# Altium project PCB.PrjPcb
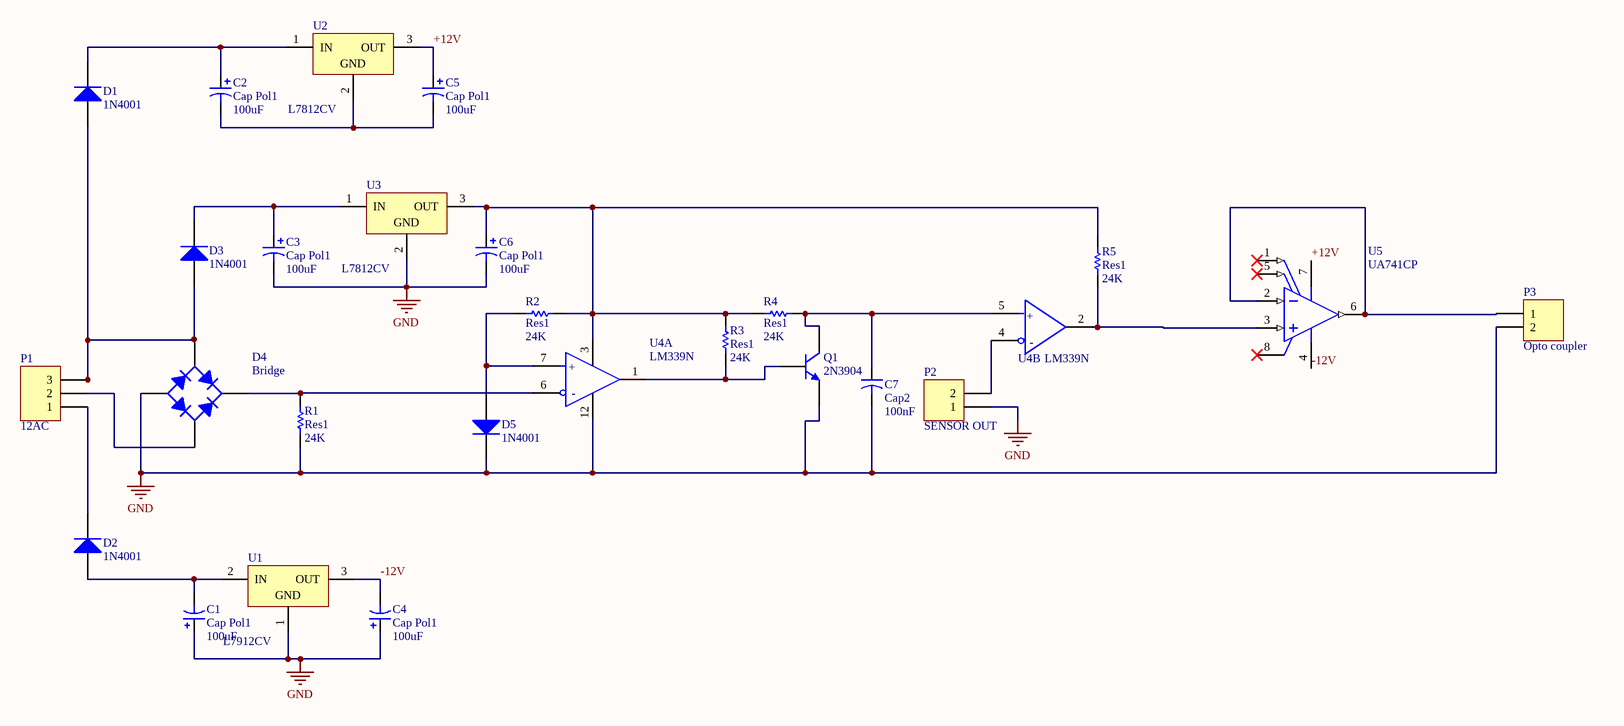
[diagram p0: Triac.SchDoc]
3 sheets, 81 parts. Net scope: global (net labels, ports and power ports of the same name join across sheets).
Board file: PCB1.PcbDoc
Sheets:
  Triac.SchDoc
  sensor.SchDoc
  pid.SchDoc

## Sheet Triac.SchDoc
size A3; SheetNumber: 1; SheetTotal: 3

### Parts
C1  Cap Pol1  value 100uF  [RB7.6-15]
C2  Cap Pol1  value 100uF  [RB7.6-15]
C3  Cap Pol1  value 100uF  [RB7.6-15]
C4  Cap Pol1  value 100uF  [RB7.6-15]
C5  Cap Pol1  value 100uF  [RB7.6-15]
C6  Cap Pol1  value 100uF  [RB7.6-15]
C7  Cap2  value 100nF  [CAPR5-4X5]
D1  1N4001  [DO-41]
D2  1N4001  [DO-41]
D3  1N4001  [DO-41]
D4  Bridge  [D-38]
D5  1N4001  [DO-41]
P1  12AC  [HDR1X3]
P2  SENSOR OUT  [HDR1X2]
P3  Opto coupler  [HDR1X2]
Q1  2N3904  [ONSC-TO-92-3-29-11]
R1  Res1  value 24K  [AXIAL-0.3]
R2  Res1  value 24K  [AXIAL-0.3]
R3  Res1  value 24K  [AXIAL-0.3]
R4  Res1  value 24K  [AXIAL-0.3]
R5  Res1  value 24K  [AXIAL-0.3]
U1  L7912CV  [TO-220]
U2  L7812CV  [TO220]
U3  L7812CV  [TO220]
U4  LM339N  [FP-N0014A-MFG]  (parts A,B of 4)
U5  UA741CP  [P0008A]

### Nets
GND: C1.1 C3.2 C4.1 C6.2 C7.2 D4.3(A) D5.2(K) P2.1 P3.2 Q1.1(C) R1.1 U1.1(GND) U3.2(GND) U4.12(GND)
+12V: C5.1 U2.3(OUT) U5.7(VCC+)
-12V: C4.2 U1.3(OUT) U5.4(VCC-)
NetC1_2: C1.2 D2.1(A) U1.2(IN)
NetC2_1: C2.1 D1.2(K) U2.1(IN)
NetC2_2: C2.2 C5.2 U2.2(GND)
NetC3_1: C3.1 D3.2(K) U3.1(IN)
NetC6_1: C6.1 R2.1 R3.1 R4.1 R5.2 U3.3(OUT) U4.3(VCC)
NetC7_1: C7.1 Q1.3(E) R4.2 U4.5(2IN+)
NetD1_1: D1.1(A) D3.1(A) D4.4(C) P1.3
NetD2_2: D2.2(K) P1.1
NetD4_1: D4.1(K) R1.2 U4.6(1IN-)
NetD4_2: D4.2(C) P1.2
NetD5_1: D5.1(A) R2.2 U4.7(1IN+)
NetP2_2: P2.2 U4.4(2IN-)
NetP3_1: P3.1 U5.2(IN-) U5.6(OUT)
NetQ1_2: Q1.2(B) R3.2 U4.1(1OUT)
NetR5_1: R5.1 U4.2(2OUT) U5.3(IN+)

Not connected (* = marked no-connect by the designer): U5 1(OFFSET_N1)* 5(OFFSET_N2)* 8(NC)*

### Notes on the sheet
- (in symbol CMP-0055-00143-4, part A) +; -
- (in symbol CMP-0055-00143-4, part B) +; -

### Library data of the parts
C1-C6 = Cap Pol1: Polarized Capacitor (Radial); Published: 8-Jun-2000; LatestRevisionDate: 17-Jul-2002; LatestRevisionNote: Re-released for DXP Platform.; PackageReference: RB7.6-15; Publisher: Altium Limited; PackageDescription: Polarized Capacitor (Radial); 2 Leads
C7 = Cap2: Capacitor; Published: 23-Sep-2002; PackageReference: CAPR5-4X5; Publisher: Altium Limited; PackageDescription: Capacitor; 2 Leads
D1-D3 D5 = Diode 1N4001: 1 Amp General Purpose Rectifier; Published: 8-Jun-2000; LatestRevisionDate: 17-Jul-2002; LatestRevisionNote: Re-released for DXP Platform.; DatasheetVersion: 1998; PackageVersion: Aug-1999; PackageReference: DO-41; Publisher: Altium Limited; PackageDescription: Diode, Axial; Body 5.2 x 2.7 mm (LxDia. max), Lead Dia. 0.86 mm (max); Code_JEDEC: DO-204-AL; ComponentLink1Description: Manufacturer Link; ComponentLink1URL: http://www.fairchildsemi.com/; ComponentLink2Description: Datasheet; ComponentLink2URL: http://www.fairchildsemi.com/ds/1N%2F1N4001.pdf
D4 = Bridge1: Full Wave Diode Bridge; Published: 8-Jun-2000; LatestRevisionDate: 29-May-2009; LatestRevisionNote: Sch pins A & K swapped.; DatasheetVersion: E2732B; PackageReference: D-38; Publisher: Altium Limited; PackageDescription: Bridge Rectifier; 4 Terminals; Body 9.4 x 9.4 mm (typ); Pitch 5.08 mm
P1 = Header 3: Header, 3-Pin; LatestRevisionDate: 17-Jul-2002; LatestRevisionNote: Re-released for DXP Platform.; Publisher: Altium Limited
P2 P3 = Header 2: Header, 2-Pin; LatestRevisionDate: 17-Jul-2002; LatestRevisionNote: Re-released for DXP Platform.; Publisher: Altium Limited
Q1 = NPN: NPN Bipolar Transistor; Published: 8-Jun-2000; LatestRevisionDate: 17-Jul-2002; LatestRevisionNote: Re-released for DXP Platform.; PackageReference: TO-226-AA; Publisher: Altium Limited; PackageDescription: TO, Flat Index; 3 In-Line, Axial Leads; Body Dia. 4.8mm; Leads 0.55 x 0.51 mm (max); Code_JEDEC: TO-226-AA
R1-R5 = Res1: Resistor; Published: 8-Jun-2000; LatestRevisionDate: 17-Jul-2002; LatestRevisionNote: Re-released for DXP Platform.; PackageReference: AXIAL-0.3; Publisher: Altium Limited; PackageDescription: Axial Device, Thru-Hole; 2 Leads; 0.3 in Pin Spacing
U1 = CMP-0244-00457-1: Negative Voltage Regulator, -12V, 3-Pin TO-220; PackageReference: TO-220; PackageVersion: 2011; PackageDescription: TO, Thru-Hole, Vertical, Heatsink Mounted; 3 In-Line Leads; Pitch 2.54 mm; ComponentLink1Description: Manufacturer URL; ComponentLink2URL: http://www.st.com/internet/com/TECHNICAL_RESOURCES/TECHNICAL_LITERATURE/DATASHEET/CD00000450.pdf; ComponentLink2Description: Datasheet; ComponentLink1URL: http://www.st.com; DatasheetVersion: 1/11/2011
U2 U3 = CMP-0244-00450-1: Positive Voltage Regulator, 12V, 3-Pin TO-220; PackageDescription: TO, Thru-Hole, Vertical, Heatsink Mounted; 3 In-Line Leads; Pitch 2.54 mm; ComponentLink3URL: http://www.st.com/internet/com/TECHNICAL_RESOURCES/TECHNICAL_LITERATURE/PACKAGE_INFORMATION/CD00004649.pdf; ComponentLink1URL: http://www.st.com; ComponentLink2Description: Datasheet; ComponentLink3Description: Package Specification; ComponentLink2URL: http://www.st.com/internet/com/TECHNICAL_RESOURCES/TECHNICAL_LITERATURE/DATASHEET/CD00000444.pdf; DatasheetVersion: 16/11/2011; PackageVersion: ver3.0; PackageReference: TO220; ComponentLink1Description: Manufacturer URL
U4 = CMP-0055-00143-4: IC QUAD DIFF COMPARATOR 14-DIP; Power Dissipation: 1.05kW; Response Time: 1.3us; Max Input Current: 250nA; Max Supply Current: 500uA; Output Current: 20mA; Output Type: TTL; Max Dual Supply Voltage: 15V; Voltage Gain: 106.02dB; Min Supply Voltage: 2V; Max Power Dissipation: 1.05W; Quiescent Current: 2.5mA; Nominal Supply Current: 2mA; Input Offset Voltage (Vos): 5mV; Number of Channels: 4; Output Current per Channel: 6mA; Max Supply Voltage: 30V; Min Dual Supply Voltage: 1V; Dual Supply Voltage: 9V; REACH SVHC: No SVHC; Max Operating Temperature: 70°C; Case/Package: PDIP; Weight: 0.032734oz; Radiation Hardening: No; Min Operating Temperature: 0°C; Number of Pins: 14; Contact Plating: Gold; Package Quantity: 25; Lead Free: Lead Free; Height: 4.57mm; Packaging: Rail/Tube; Input Bias Current: 250nA; Number of Elements: 4; Mount: Through Hole; Width: 6.35mm; Length: 19.3mm
U5 = CMP-0017-00973-2: General-Purpose Operational Amplifier, 7 to 36 V, 0 to 70 degC, 8-pin DIP (P8), Pb-Free (RoHS); Manufacturer: Texas Instruments; Iq per channel(Max)(mA): 2.8; Number of Channels: 1; Total Supply Voltage(Min)(+5V is 5, +/-5V is 10): 7; IIB(Max)(pA): 800000; Slew Rate(Typ)(V/us): 0.5; Total Supply Voltage(Max)(+5V is 5, +/-5V is 10): 36; Vio (25C)(Max)(mV): 6; CMRR(Min)(dB): 70; Sub Family: General Purpose Amplifier, High Supply Voltage Amplifier (>=30V); PackageVersion: 4040082/E, 04/2010; PackageReference: P0008A; ComponentLink1URL: http://www.ti.com/; Mounting Technology: Through Hole; ComponentLink1Description: Manufacturer URL; GBW(Typ)(MHz): 1; ComponentLink2Description: Datasheet; ComponentLink2URL: http://www.ti.com/lit/ds/symlink/ua741.pdf; PartNumber: UA741CP; Code_JEDEC: MS-001; ComponentLink3Description: Package Specification; DatasheetVersion: SLOS094B; ComponentLink3URL: http://www.ti.com/litv/pdf/mpdi001b; PackageDescription: 8-Pin Plastic In-Line, Body 9.59 x 6.35 mm, Pitch 2.54 mm; Eco-Plan: Pb-Free (RoHS)

## Sheet sensor.SchDoc
size A3; SheetNumber: 2; SheetTotal: 3
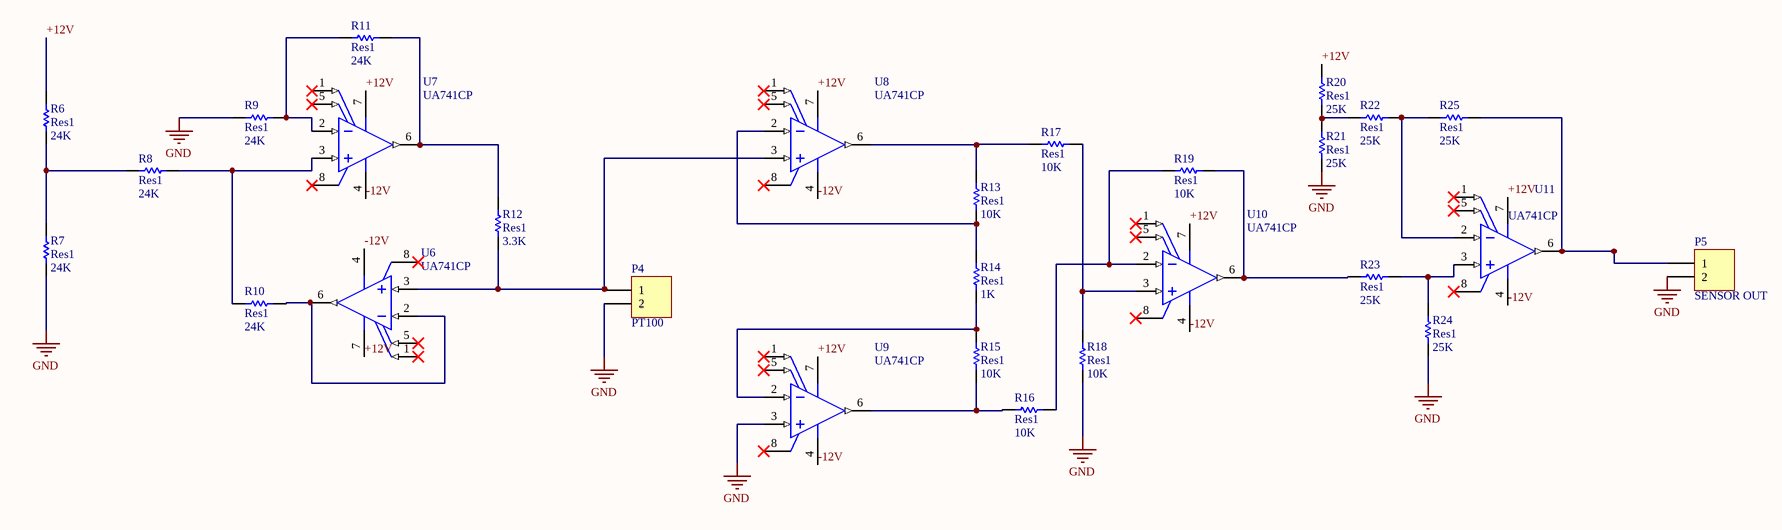
[diagram p1: sensor.SchDoc]

### Parts
P4  PT100  [HDR1X2]
P5  SENSOR OUT  [HDR1X2]
R6  Res1  value 24K  [AXIAL-0.3]
R7  Res1  value 24K  [AXIAL-0.3]
R8  Res1  value 24K  [AXIAL-0.3]
R9  Res1  value 24K  [AXIAL-0.3]
R10  Res1  value 24K  [AXIAL-0.3]
R11  Res1  value 24K  [AXIAL-0.3]
R12  Res1  value 3.3K  [AXIAL-0.3]
R13  Res1  value 10K  [AXIAL-0.3]
R14  Res1  value 1K  [AXIAL-0.3]
R15  Res1  value 10K  [AXIAL-0.3]
R16  Res1  value 10K  [AXIAL-0.3]
R17  Res1  value 10K  [AXIAL-0.3]
R18  Res1  value 10K  [AXIAL-0.3]
R19  Res1  value 10K  [AXIAL-0.3]
R20  Res1  value 25K  [AXIAL-0.3]
R21  Res1  value 25K  [AXIAL-0.3]
R22  Res1  value 25K  [AXIAL-0.3]
R23  Res1  value 25K  [AXIAL-0.3]
R24  Res1  value 25K  [AXIAL-0.3]
R25  Res1  value 25K  [AXIAL-0.3]
U6  UA741CP  [P0008A]
U7  UA741CP  [P0008A]
U8  UA741CP  [P0008A]
U9  UA741CP  [P0008A]
U10  UA741CP  [P0008A]
U11  UA741CP  [P0008A]

### Nets
GND: P4.2 P5.2 R7.1 R9.2 R18.2 R21.1 R24.2 U9.3(IN+)
+12V: R6.2 R20.2 U6.7(VCC+) U7.7(VCC+) U8.7(VCC+) U9.7(VCC+) U10.7(VCC+) U11.7(VCC+)
-12V: U6.4(VCC-) U7.4(VCC-) U8.4(VCC-) U9.4(VCC-) U10.4(VCC-) U11.4(VCC-)
NetP4_1: P4.1 R12.2 U6.3(IN+) U8.3(IN+)
NetP5_1: P5.1 R25.2 U11.6(OUT)
NetR6_1: R6.1 R7.2 R8.2
NetR8_1: R8.1 R10.2 U7.3(IN+)
NetR9_1: R9.1 R11.2 U7.2(IN-)
NetR10_1: R10.1 U6.2(IN-) U6.6(OUT)
NetR11_1: R11.1 R12.1 U7.6(OUT)
NetR13_1: R13.1 R17.1 U8.6(OUT)
NetR13_2: R13.2 R14.1 U8.2(IN-)
NetR14_2: R14.2 R15.1 U9.2(IN-)
NetR15_2: R15.2 R16.1 U9.6(OUT)
NetR16_2: R16.2 R19.1 U10.2(IN-)
NetR17_2: R17.2 R18.1 U10.3(IN+)
NetR19_2: R19.2 R23.1 U10.6(OUT)
NetR20_1: R20.1 R21.2 R22.1
NetR22_2: R22.2 R25.1 U11.2(IN-)
NetR23_2: R23.2 R24.1 U11.3(IN+)

Not connected (* = marked no-connect by the designer): U6 1(OFFSET_N1)* 5(OFFSET_N2)* 8(NC)*; U7 1(OFFSET_N1)* 5(OFFSET_N2)* 8(NC)*; U8 1(OFFSET_N1)* 5(OFFSET_N2)* 8(NC)*; U9 1(OFFSET_N1)* 5(OFFSET_N2)* 8(NC)*; U10 1(OFFSET_N1)* 5(OFFSET_N2)* 8(NC)*; U11 1(OFFSET_N1)* 5(OFFSET_N2)* 8(NC)*

### Library data of the parts
P4 P5 = Header 2: Header, 2-Pin; LatestRevisionDate: 17-Jul-2002; LatestRevisionNote: Re-released for DXP Platform.; Publisher: Altium Limited
R6-R25 = Res1: Resistor; Published: 8-Jun-2000; LatestRevisionDate: 17-Jul-2002; LatestRevisionNote: Re-released for DXP Platform.; PackageReference: AXIAL-0.3; Publisher: Altium Limited; PackageDescription: Axial Device, Thru-Hole; 2 Leads; 0.3 in Pin Spacing
U6-U11 = CMP-0017-00973-2: as U5 on sheet Triac; PackageVersion: 4040082/E, 04/2010; PackageReference: P0008A; ComponentLink1URL: http://www.ti.com/; Mounting Technology: Through Hole; ComponentLink1Description: Manufacturer URL; GBW(Typ)(MHz): 1; ComponentLink2Description: Datasheet; ComponentLink2URL: http://www.ti.com/lit/ds/symlink/ua741.pdf; PartNumber: UA741CP; Code_JEDEC: MS-001; ComponentLink3Description: Package Specification; DatasheetVersion: SLOS094B; ComponentLink3URL: http://www.ti.com/litv/pdf/mpdi001b; PackageDescription: 8-Pin Plastic In-Line, Body 9.59 x 6.35 mm, Pitch 2.54 mm; Eco-Plan: Pb-Free (RoHS)

## Sheet pid.SchDoc
size A3; SheetNumber: 3; SheetTotal: 3
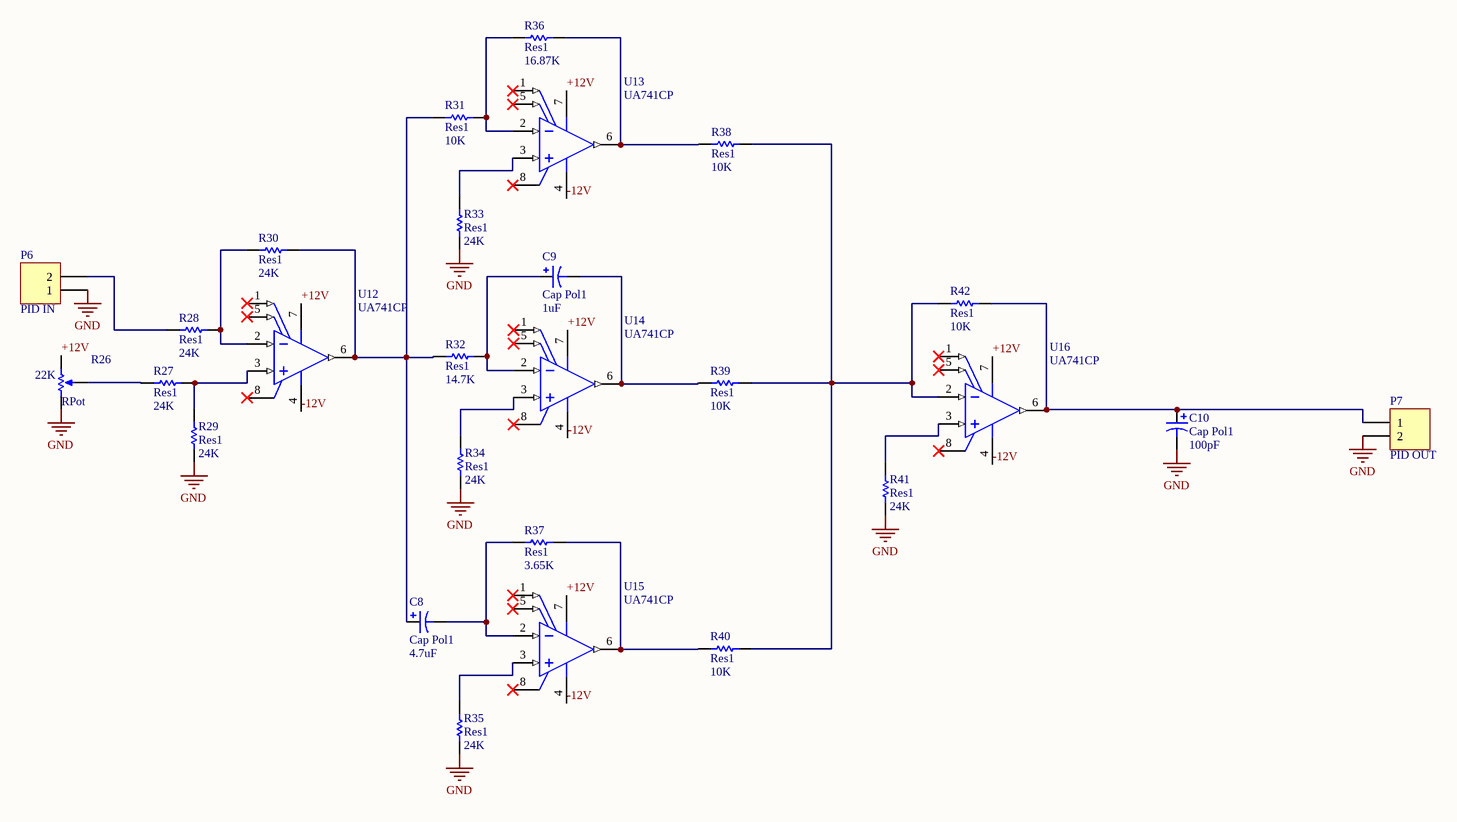
[diagram p2: pid.SchDoc]

### Parts
C8  Cap Pol1  value 4.7uF  [RB7.6-15]
C9  Cap Pol1  value 1uF  [RB7.6-15]
C10  Cap Pol1  value 100pF  [RB7.6-15]
P6  PID IN  [HDR1X2]
P7  PID OUT  [HDR1X2]
R26  RPot  value 22K  [VR5]
R27  Res1  value 24K  [AXIAL-0.3]
R28  Res1  value 24K  [AXIAL-0.3]
R29  Res1  value 24K  [AXIAL-0.3]
R30  Res1  value 24K  [AXIAL-0.3]
R31  Res1  value 10K  [AXIAL-0.3]
R32  Res1  value 14.7K  [AXIAL-0.3]
R33  Res1  value 24K  [AXIAL-0.3]
R34  Res1  value 24K  [AXIAL-0.3]
R35  Res1  value 24K  [AXIAL-0.3]
R36  Res1  value 16.87K  [AXIAL-0.3]
R37  Res1  value 3.65K  [AXIAL-0.3]
R38  Res1  value 10K  [AXIAL-0.3]
R39  Res1  value 10K  [AXIAL-0.3]
R40  Res1  value 10K  [AXIAL-0.3]
R41  Res1  value 24K  [AXIAL-0.3]
R42  Res1  value 10K  [AXIAL-0.3]
U12  UA741CP  [P0008A]
U13  UA741CP  [P0008A]
U14  UA741CP  [P0008A]
U15  UA741CP  [P0008A]
U16  UA741CP  [P0008A]

### Nets
GND: C10.2 P6.1 P7.2 R26.1(TOP) R29.2 R33.2 R34.2 R35.2 R41.2
+12V: R26.2(BOT) U12.7(VCC+) U13.7(VCC+) U14.7(VCC+) U15.7(VCC+) U16.7(VCC+)
-12V: U12.4(VCC-) U13.4(VCC-) U14.4(VCC-) U15.4(VCC-) U16.4(VCC-)
NetC8_1: C8.1 R30.1 R31.2 R32.2 U12.6(OUT)
NetC8_2: C8.2 R37.2 U15.2(IN-)
NetC9_1: C9.1 R32.1 U14.2(IN-)
NetC9_2: C9.2 R39.2 U14.6(OUT)
NetC10_1: C10.1 P7.1 R42.1 U16.6(OUT)
NetP6_2: P6.2 R28.2
NetR26_3: R26.3(TAP) R27.2
NetR27_1: R27.1 R29.1 U12.3(IN+)
NetR28_1: R28.1 R30.2 U12.2(IN-)
NetR31_1: R31.1 R36.2 U13.2(IN-)
NetR33_1: R33.1 U13.3(IN+)
NetR34_1: R34.1 U14.3(IN+)
NetR35_1: R35.1 U15.3(IN+)
NetR36_1: R36.1 R38.2 U13.6(OUT)
NetR37_1: R37.1 R40.2 U15.6(OUT)
NetR38_1: R38.1 R39.1 R40.1 R42.2 U16.2(IN-)
NetR41_1: R41.1 U16.3(IN+)

Not connected (* = marked no-connect by the designer): U12 1(OFFSET_N1)* 5(OFFSET_N2)* 8(NC)*; U13 1(OFFSET_N1)* 5(OFFSET_N2)* 8(NC)*; U14 1(OFFSET_N1)* 5(OFFSET_N2)* 8(NC)*; U15 1(OFFSET_N1)* 5(OFFSET_N2)* 8(NC)*; U16 1(OFFSET_N1)* 5(OFFSET_N2)* 8(NC)*

### Library data of the parts
C8-C10 = Cap Pol1: Polarized Capacitor (Radial); Published: 8-Jun-2000; LatestRevisionDate: 17-Jul-2002; LatestRevisionNote: Re-released for DXP Platform.; PackageReference: RB7.6-15; Publisher: Altium Limited; PackageDescription: Polarized Capacitor (Radial); 2 Leads
P6 P7 = Header 2: Header, 2-Pin; LatestRevisionDate: 17-Jul-2002; LatestRevisionNote: Re-released for DXP Platform.; Publisher: Altium Limited
R26 = RPot: Potentiometer; Sim Note: Enter the Resistance value and the set point into parameter fields.; Set Position: 0.5; Published: 8-Jun-2000; LatestRevisionDate: 17-Jul-2002; LatestRevisionNote: Re-released for DXP Platform.; PackageReference: VR5; Publisher: Altium Limited; PackageDescription: Variable Resistor, Thru-Hole; 3 Leads
R27-R42 = Res1: Resistor; Published: 8-Jun-2000; LatestRevisionDate: 17-Jul-2002; LatestRevisionNote: Re-released for DXP Platform.; PackageReference: AXIAL-0.3; Publisher: Altium Limited; PackageDescription: Axial Device, Thru-Hole; 2 Leads; 0.3 in Pin Spacing
U12-U16 = CMP-0017-00973-2: as U5 on sheet Triac; PackageVersion: 4040082/E, 04/2010; PackageReference: P0008A; ComponentLink1URL: http://www.ti.com/; Mounting Technology: Through Hole; ComponentLink1Description: Manufacturer URL; GBW(Typ)(MHz): 1; ComponentLink2Description: Datasheet; ComponentLink2URL: http://www.ti.com/lit/ds/symlink/ua741.pdf; PartNumber: UA741CP; Code_JEDEC: MS-001; ComponentLink3Description: Package Specification; DatasheetVersion: SLOS094B; ComponentLink3URL: http://www.ti.com/litv/pdf/mpdi001b; PackageDescription: 8-Pin Plastic In-Line, Body 9.59 x 6.35 mm, Pitch 2.54 mm; Eco-Plan: Pb-Free (RoHS)

## Nets that join several sheets
GND: Triac (14 pins), sensor (8 pins), pid (9 pins)
+12V: Triac (C5.1 U2.3 U5.7), sensor (8 pins), pid (6 pins)
-12V: Triac (C4.2 U1.3 U5.4), sensor (6 pins), pid (5 pins)